# Altium schematic sheet oscillation.SchDoc
size A4
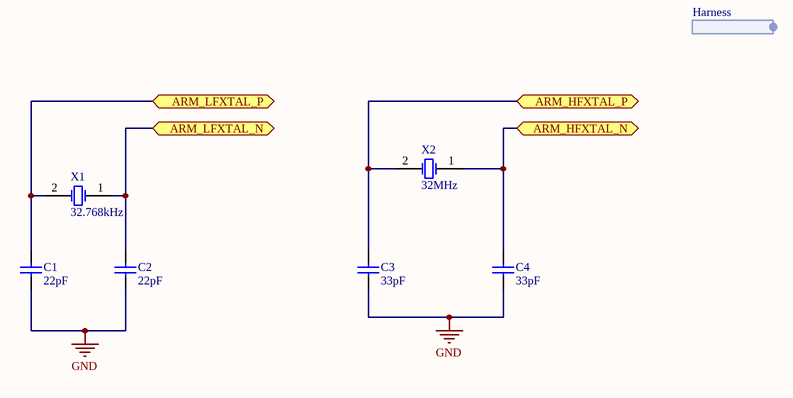
[diagram p0: oscillation.SchDoc]

## Parts
C1  value 22pF  [RAD-0.3]  (hidden comment: Cap)
C2  value 22pF  [RAD-0.3]  (hidden comment: Cap)
C3  value 33pF  [RAD-0.3]  (hidden comment: Cap)
C4  value 33pF  [RAD-0.3]  (hidden comment: Cap)
X1  32.768kHz  [R38]
X2  32MHz  [R38]

## Ports
ARM_HFXTAL_N (bidir), ARM_HFXTAL_P (bidir), ARM_LFXTAL_N (bidir), ARM_LFXTAL_P (bidir)

## Harnesses
Harness: 

## Nets
GND: C1.1 C2.1 C3.1 C4.1
ARM_HFXTAL_N: C4.2 X2.1(OSC1) ; port ARM_HFXTAL_N
ARM_HFXTAL_P: C3.2 X2.2(OSC2) ; port ARM_HFXTAL_P
ARM_LFXTAL_N: C2.2 X1.1(OSC1) ; port ARM_LFXTAL_N
ARM_LFXTAL_P: C1.2 X1.2(OSC2) ; port ARM_LFXTAL_P

## Library data of the parts
C1-C4 = Cap: Capacitor; Published: 8-Jun-2000; LatestRevisionDate: 17-Jul-2002; LatestRevisionNote: Re-released for DXP Platform.; PackageReference: RAD-0.3; Publisher: Altium Limited; PackageDescription: Radial Cap, Thru-Hole; 2 Leads; 0.3 in Pin Spacing
X1 X2 = XTAL: Crystal Oscillator; Published: 8-Jun-2000; LatestRevisionDate: 17-Jul-2002; LatestRevisionNote: Re-released for DXP Platform.; PackageReference: R38; Publisher: Altium Limited; PackageDescription: Crystal, Thru-Hole; 2 Leads; Body 3.1 x 8.2 mm (Dia.xH)